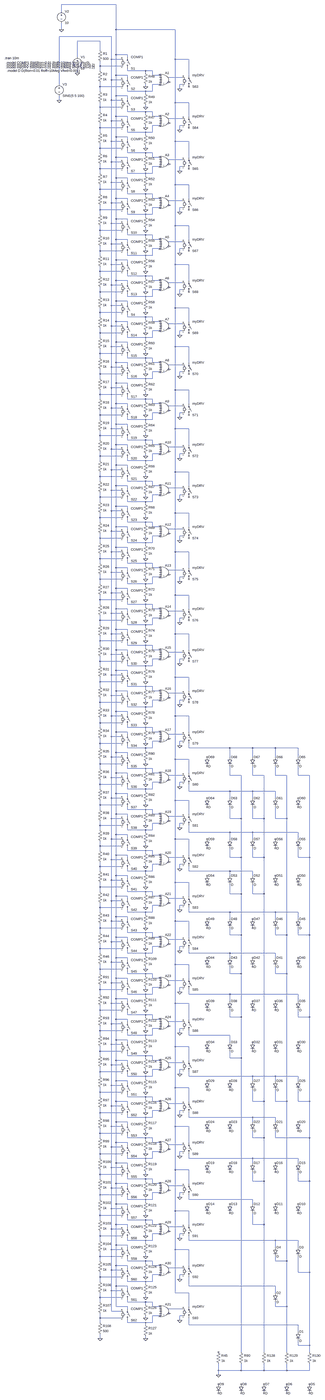
[diagram p0: schematic my_Flash-ADC.asc, whole sheet]
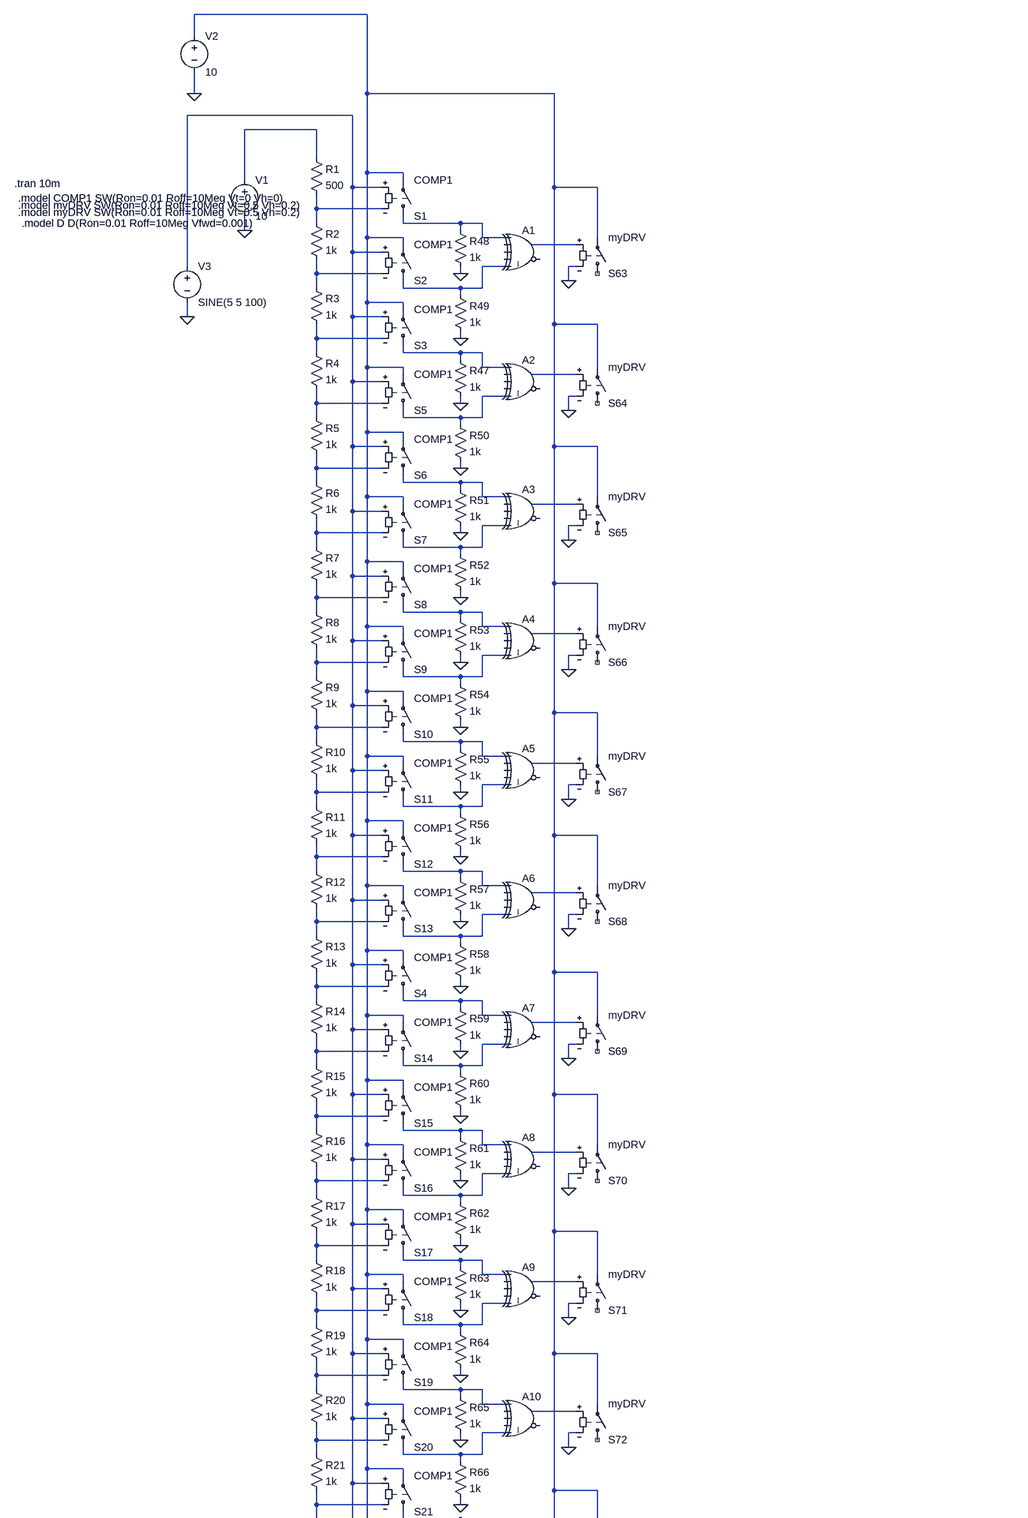
[diagram p1: schematic my_Flash-ADC.asc, part, row 1 of 3, column 1 of 1]
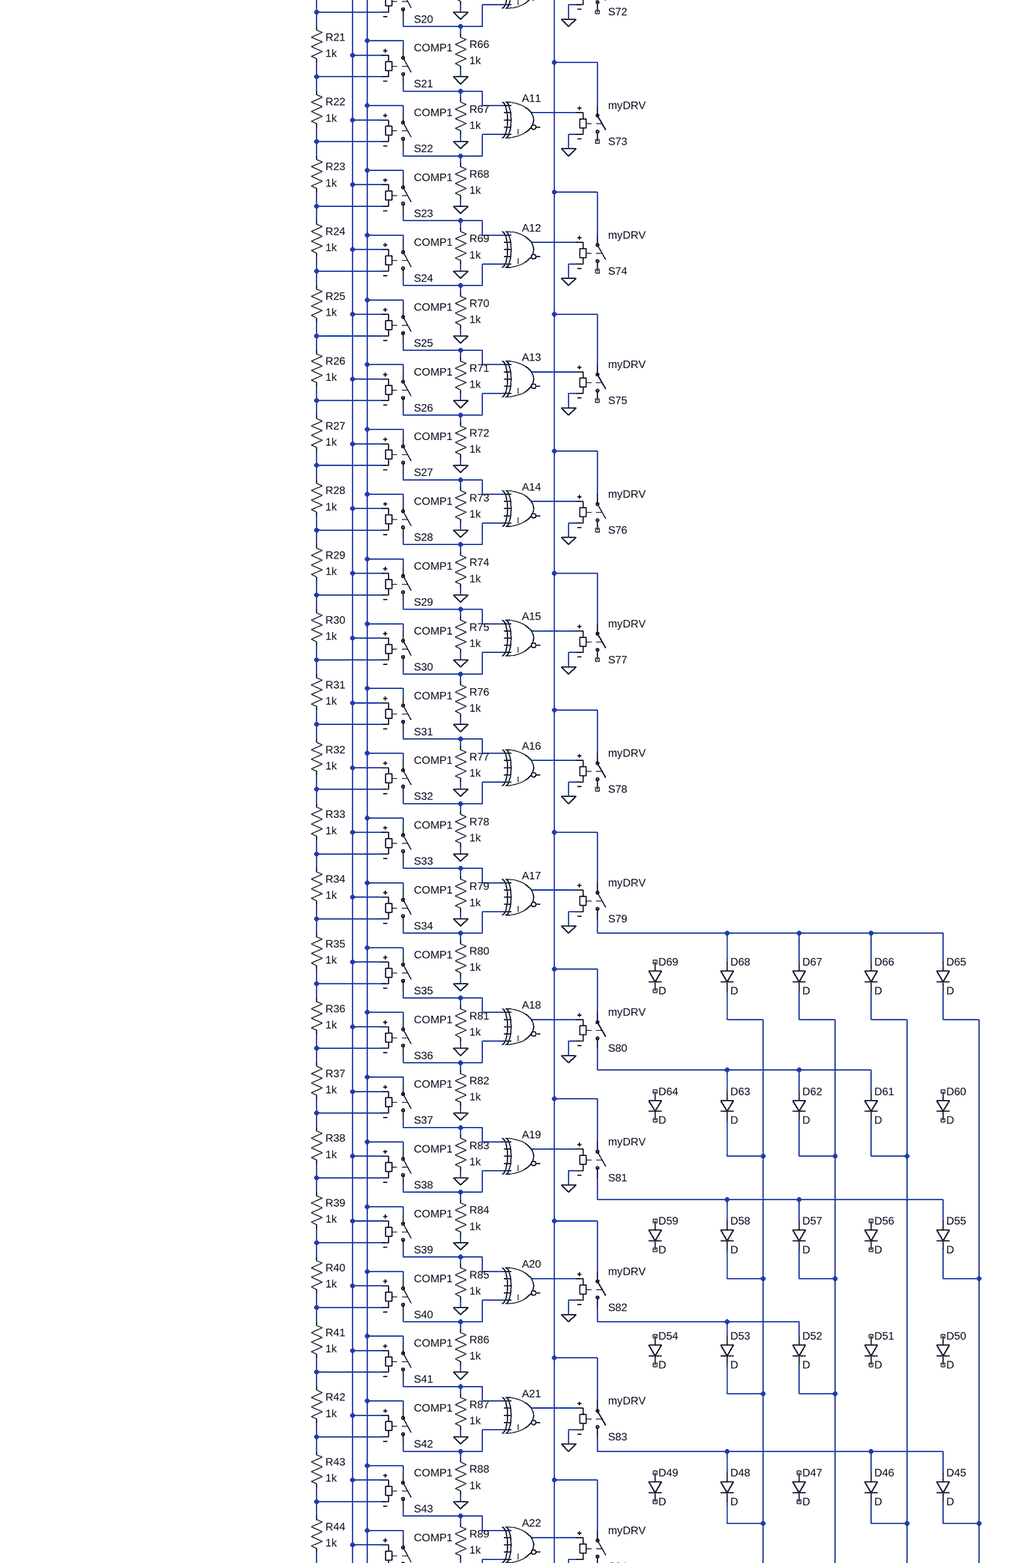
[diagram p2: schematic my_Flash-ADC.asc, part, row 2 of 3, column 1 of 1]
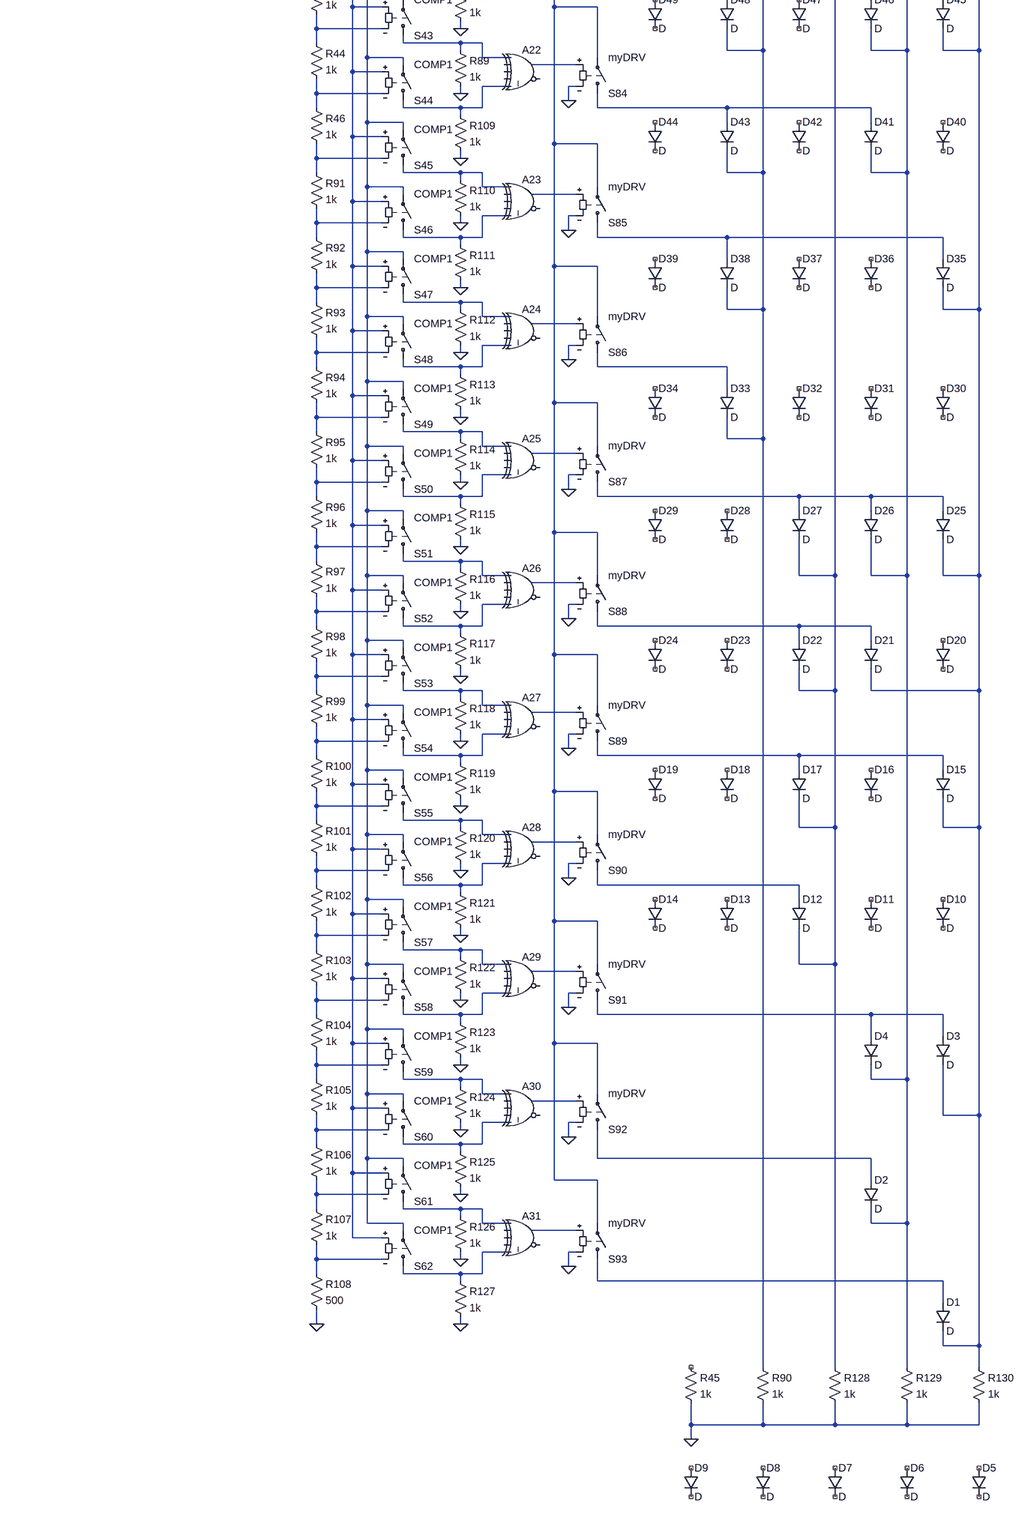
[diagram p3: schematic my_Flash-ADC.asc, part, row 3 of 3, column 1 of 1]
* my_Flash-ADC.asc
V1 N003 0 10
R1 N003 N004 500
S1 N005 N001 N002 N004 COMP1
V2 N001 0 10
V3 N002 0 SINE(5 5 100)
R2 N004 N008 1k
R3 N008 N009 1k
R4 N009 N013 1k
S2 N007 N001 N002 N008 COMP1
S3 N010 N001 N002 N009 COMP1
S5 N012 N001 N002 N013 COMP1
R5 N013 N014 1k
R6 N014 N018 1k
R7 N018 N019 1k
S6 N015 N001 N002 N014 COMP1
S7 N017 N001 N002 N018 COMP1
S8 N020 N001 N002 N019 COMP1
R8 N019 N023 1k
R9 N023 N024 1k
R10 N024 N028 1k
S9 N022 N001 N002 N023 COMP1
S10 N025 N001 N002 N024 COMP1
S11 N027 N001 N002 N028 COMP1
R11 N028 N029 1k
R12 N029 N033 1k
R13 N033 N034 1k
S12 N030 N001 N002 N029 COMP1
S13 N032 N001 N002 N033 COMP1
R14 N034 N038 1k
R15 N038 N039 1k
S4 N035 N001 N002 N034 COMP1
S14 N037 N001 N002 N038 COMP1
S15 N040 N001 N002 N039 COMP1
R16 N039 N043 1k
R17 N043 N044 1k
R18 N044 N048 1k
S16 N042 N001 N002 N043 COMP1
S17 N045 N001 N002 N044 COMP1
S18 N047 N001 N002 N048 COMP1
R19 N048 N049 1k
R20 N049 N053 1k
R21 N053 N054 1k
S19 N050 N001 N002 N049 COMP1
S20 N052 N001 N002 N053 COMP1
S21 N055 N001 N002 N054 COMP1
R22 N054 N058 1k
R23 N058 N059 1k
R24 N059 N063 1k
S22 N057 N001 N002 N058 COMP1
S23 N060 N001 N002 N059 COMP1
R25 N063 N064 1k
R26 N064 N068 1k
S24 N062 N001 N002 N063 COMP1
S25 N065 N001 N002 N064 COMP1
S26 N067 N001 N002 N068 COMP1
R27 N068 N069 1k
R28 N069 N073 1k
R29 N073 N074 1k
S27 N070 N001 N002 N069 COMP1
S28 N072 N001 N002 N073 COMP1
S29 N075 N001 N002 N074 COMP1
R30 N074 N078 1k
R31 N078 N079 1k
R32 N079 N083 1k
S30 N077 N001 N002 N078 COMP1
S31 N080 N001 N002 N079 COMP1
S32 N082 N001 N002 N083 COMP1
R33 N083 N084 1k
R34 N084 N088 1k
R35 N088 N090 1k
S33 N085 N001 N002 N084 COMP1
S34 N087 N001 N002 N088 COMP1
R36 N090 N098 1k
R37 N098 N100 1k
S35 N091 N001 N002 N090 COMP1
S36 N097 N001 N002 N098 COMP1
S37 N101 N001 N002 N100 COMP1
R38 N100 N104 1k
R39 N104 N106 1k
R40 N106 N110 1k
S38 N103 N001 N002 N104 COMP1
S39 N107 N001 N002 N106 COMP1
S40 N109 N001 N002 N110 COMP1
R41 N110 N112 1k
R42 N112 N116 1k
R43 N116 N118 1k
S41 N113 N001 N002 N112 COMP1
S42 N115 N001 N002 N116 COMP1
S43 N119 N001 N002 N118 COMP1
R44 N118 N122 1k
S44 N121 N001 N002 N122 COMP1
A1 N005 0 0 0 N007 0 N006 0 XOR
R48 N005 0 1k
R49 N007 0 1k
A2 N010 0 0 0 N012 0 N011 0 XOR
R47 N010 0 1k
R50 N012 0 1k
A3 N015 0 0 0 N017 0 N016 0 XOR
R51 N015 0 1k
R52 N017 0 1k
A4 N020 0 0 0 N022 0 N021 0 XOR
R53 N020 0 1k
R54 N022 0 1k
A5 N025 0 0 0 N027 0 N026 0 XOR
R55 N025 0 1k
R56 N027 0 1k
A6 N030 0 0 0 N032 0 N031 0 XOR
R57 N030 0 1k
R58 N032 0 1k
A7 N035 0 0 0 N037 0 N036 0 XOR
R59 N035 0 1k
R60 N037 0 1k
A8 N040 0 0 0 N042 0 N041 0 XOR
R61 N040 0 1k
R62 N042 0 1k
A9 N045 0 0 0 N047 0 N046 0 XOR
R63 N045 0 1k
R64 N047 0 1k
A10 N050 0 0 0 N052 0 N051 0 XOR
R65 N050 0 1k
R66 N052 0 1k
A11 N055 0 0 0 N057 0 N056 0 XOR
R67 N055 0 1k
R68 N057 0 1k
A12 N060 0 0 0 N062 0 N061 0 XOR
R69 N060 0 1k
R70 N062 0 1k
A13 N065 0 0 0 N067 0 N066 0 XOR
R71 N065 0 1k
R72 N067 0 1k
A14 N070 0 0 0 N072 0 N071 0 XOR
R73 N070 0 1k
R74 N072 0 1k
A15 N075 0 0 0 N077 0 N076 0 XOR
R75 N075 0 1k
R76 N077 0 1k
A16 N080 0 0 0 N082 0 N081 0 XOR
R77 N080 0 1k
R78 N082 0 1k
A17 N085 0 0 0 N087 0 N086 0 XOR
R79 N085 0 1k
R80 N087 0 1k
A18 N091 0 0 0 N097 0 N092 0 XOR
R81 N091 0 1k
R82 N097 0 1k
A19 N101 0 0 0 N103 0 N102 0 XOR
R83 N101 0 1k
R84 N103 0 1k
A20 N107 0 0 0 N109 0 N108 0 XOR
R85 N107 0 1k
R86 N109 0 1k
A21 N113 0 0 0 N115 0 N114 0 XOR
R87 N113 0 1k
R88 N115 0 1k
A22 N119 0 0 0 N121 0 N120 0 XOR
R89 N119 0 1k
R46 N122 N124 1k
R91 N124 N128 1k
R92 N128 N130 1k
S45 N125 N001 N002 N124 COMP1
S46 N127 N001 N002 N128 COMP1
S47 N131 N001 N002 N130 COMP1
R93 N130 N134 1k
R94 N134 N136 1k
R95 N136 N140 1k
S48 N133 N001 N002 N134 COMP1
S49 N137 N001 N002 N136 COMP1
S50 N139 N001 N002 N140 COMP1
R96 N140 N142 1k
R97 N142 N146 1k
R98 N146 N148 1k
S51 N143 N001 N002 N142 COMP1
S52 N145 N001 N002 N146 COMP1
R99 N148 N152 1k
R100 N152 N154 1k
S53 N149 N001 N002 N148 COMP1
S54 N151 N001 N002 N152 COMP1
S55 N155 N001 N002 N154 COMP1
R101 N154 N158 1k
R102 N158 N160 1k
R103 N160 N164 1k
S56 N157 N001 N002 N158 COMP1
S57 N161 N001 N002 N160 COMP1
S58 N163 N001 N002 N164 COMP1
R104 N164 N166 1k
R105 N166 N170 1k
R106 N170 N172 1k
S59 N167 N001 N002 N166 COMP1
S60 N169 N001 N002 N170 COMP1
S61 N173 N001 N002 N172 COMP1
R107 N172 N176 1k
R108 N176 0 500
S62 N175 N001 N002 N176 COMP1
R109 N121 0 1k
A23 N125 0 0 0 N127 0 N126 0 XOR
R110 N125 0 1k
R111 N127 0 1k
A24 N131 0 0 0 N133 0 N132 0 XOR
R112 N131 0 1k
R113 N133 0 1k
A25 N137 0 0 0 N139 0 N138 0 XOR
R114 N137 0 1k
R115 N139 0 1k
A26 N143 0 0 0 N145 0 N144 0 XOR
R116 N143 0 1k
R117 N145 0 1k
A27 N149 0 0 0 N151 0 N150 0 XOR
R118 N149 0 1k
R119 N151 0 1k
A28 N155 0 0 0 N157 0 N156 0 XOR
R120 N155 0 1k
R121 N157 0 1k
A29 N161 0 0 0 N163 0 N162 0 XOR
R122 N161 0 1k
R123 N163 0 1k
A30 N167 0 0 0 N169 0 N168 0 XOR
R124 N167 0 1k
R125 N169 0 1k
A31 N173 0 0 0 N175 0 N174 0 XOR
R126 N173 0 1k
R127 N175 0 1k
R45 NC_01 0 1k
R90 N093 0 1k
R128 N094 0 1k
R129 N095 0 1k
R130 N096 0 1k
S63 NC_02 N001 N006 0 myDRV
S64 NC_03 N001 N011 0 myDRV
S65 NC_04 N001 N016 0 myDRV
S66 NC_05 N001 N021 0 myDRV
S67 NC_06 N001 N026 0 myDRV
S68 NC_07 N001 N031 0 myDRV
S69 NC_08 N001 N036 0 myDRV
S70 NC_09 N001 N041 0 myDRV
S71 NC_10 N001 N046 0 myDRV
S72 NC_11 N001 N051 0 myDRV
S73 NC_12 N001 N056 0 myDRV
S74 NC_13 N001 N061 0 myDRV
S75 NC_14 N001 N066 0 myDRV
S76 NC_15 N001 N071 0 myDRV
S77 NC_16 N001 N076 0 myDRV
S78 NC_17 N001 N081 0 myDRV
S79 N089 N001 N086 0 myDRV
S80 N099 N001 N092 0 myDRV
S81 N105 N001 N102 0 myDRV
S82 N111 N001 N108 0 myDRV
S83 N117 N001 N114 0 myDRV
S84 N123 N001 N120 0 myDRV
S85 N129 N001 N126 0 myDRV
S86 N135 N001 N132 0 myDRV
S87 N141 N001 N138 0 myDRV
S88 N147 N001 N144 0 myDRV
S89 N153 N001 N150 0 myDRV
S90 N159 N001 N156 0 myDRV
S91 N165 N001 N162 0 myDRV
S92 N171 N001 N168 0 myDRV
S93 N177 N001 N174 0 myDRV
D1 N177 N096 D
D2 N171 N095 D
D3 N165 N096 D
D4 N165 N095 D
D5 NC_18 NC_19 D
D6 NC_20 NC_21 D
D7 NC_22 NC_23 D
D8 NC_24 NC_25 D
D9 NC_26 NC_27 D
D10 NC_28 NC_29 D
D11 NC_30 NC_31 D
D12 N159 N094 D
D13 NC_32 NC_33 D
D14 NC_34 NC_35 D
D15 N153 N096 D
D16 NC_36 NC_37 D
D17 N153 N094 D
D18 NC_38 NC_39 D
D19 NC_40 NC_41 D
D20 NC_42 NC_43 D
D21 N147 N096 D
D22 N147 N094 D
D23 NC_44 NC_45 D
D24 NC_46 NC_47 D
D25 N141 N096 D
D26 N141 N095 D
D27 N141 N094 D
D28 NC_48 NC_49 D
D29 NC_50 NC_51 D
D30 NC_52 NC_53 D
D31 NC_54 NC_55 D
D32 NC_56 NC_57 D
D33 N135 N093 D
D34 NC_58 NC_59 D
D35 N129 N096 D
D36 NC_60 NC_61 D
D37 NC_62 NC_63 D
D38 N129 N093 D
D39 NC_64 NC_65 D
D40 NC_66 NC_67 D
D41 N123 N095 D
D42 NC_68 NC_69 D
D43 N123 N093 D
D44 NC_70 NC_71 D
D45 N117 N096 D
D46 N117 N095 D
D47 NC_72 NC_73 D
D48 N117 N093 D
D49 NC_74 NC_75 D
D50 NC_76 NC_77 D
D51 NC_78 NC_79 D
D52 N111 N094 D
D53 N111 N093 D
D54 NC_80 NC_81 D
D55 N105 N096 D
D56 NC_82 NC_83 D
D57 N105 N094 D
D58 N105 N093 D
D59 NC_84 NC_85 D
D60 NC_86 NC_87 D
D61 N099 N095 D
D62 N099 N094 D
D63 N099 N093 D
D64 NC_88 NC_89 D
D65 N089 N096 D
D66 N089 N095 D
D67 N089 N094 D
D68 N089 N093 D
D69 NC_90 NC_91 D
.model D D
.lib standard.dio
.model COMP1 SW(Ron=0.01 Roff=10Meg Vt=0 Vh=0)
.tran 10m
.model myDRV SW(Ron=0.01 Roff=10Meg Vt=0.5 Vh=0.2)
.model myDRV SW(Ron=0.01 Roff=10Meg Vt=0.5 Vh=0.2)
.model D D(Ron=0.01 Roff=10Meg Vfwd=0.001)
.backanno
.end